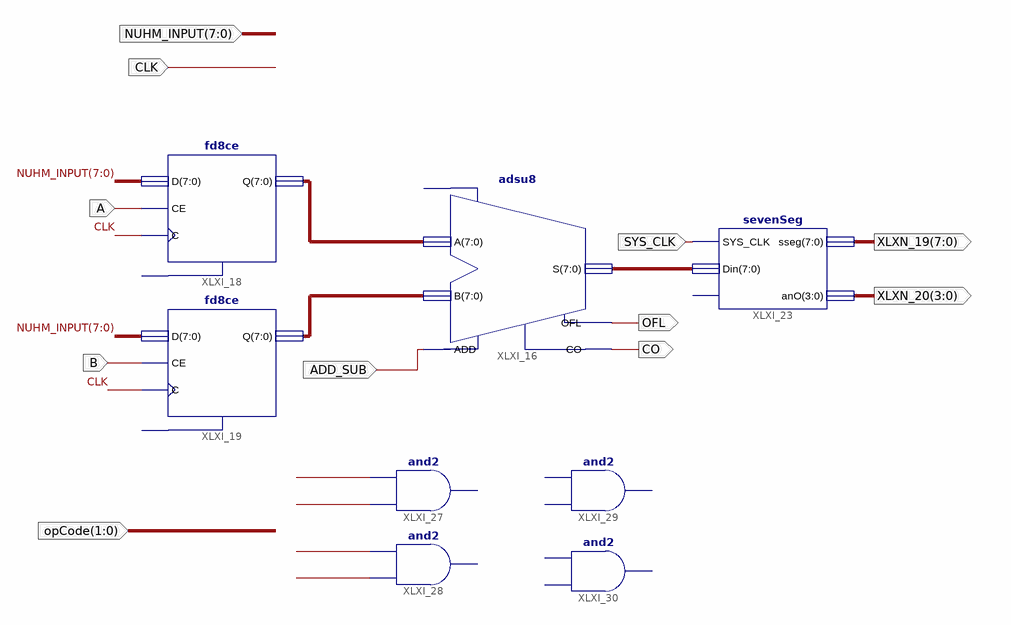
[diagram p0: schematic sheet 1]
// Xilinx ISE schematic sandbox.sch (spartan3e) as structural Verilog: 8 symbols, 11 ports
module sandbox (
  input  [7:0] NUHM_INPUT,
  input  CLK,
  input  A,
  input  B,
  input  ADD_SUB,
  input  SYS_CLK,
  input  [1:0] opCode,
  output OFL,
  output CO,
  output [7:0] XLXN_19,
  output [3:0] XLXN_20
);

  wire XLXN_51, XLXN_52, XLXN_53, XLXN_54;
  wire [7:0] RESULT, XLXN_1, XLXN_6;

  adsu8 XLXI_16 (.A(XLXN_1), .ADD(ADD_SUB), .B(XLXN_6), .CO(CO), .OFL(OFL), .S(RESULT));  // open: CI
  fd8ce XLXI_19 (.C(CLK), .CE(B), .D(NUHM_INPUT), .Q(XLXN_6));  // open: CLR
  fd8ce XLXI_18 (.C(CLK), .CE(A), .D(NUHM_INPUT), .Q(XLXN_1));  // open: CLR
  sevenSeg XLXI_23 (.SYS_CLK(SYS_CLK), .Din(RESULT), .sseg(XLXN_19), .anO(XLXN_20));  // open: En
  // and2 XLXI_28 has open pins: I0=XLXN_54, I1=XLXN_53, O=open
  // and2 XLXI_27 has open pins: I0=XLXN_52, I1=XLXN_51, O=open
  // and2 XLXI_29 is placed but not wired
  // and2 XLXI_30 is placed but not wired
endmodule
